# EAGLE schematic Main_Flam (EAGLE 7.1.0)
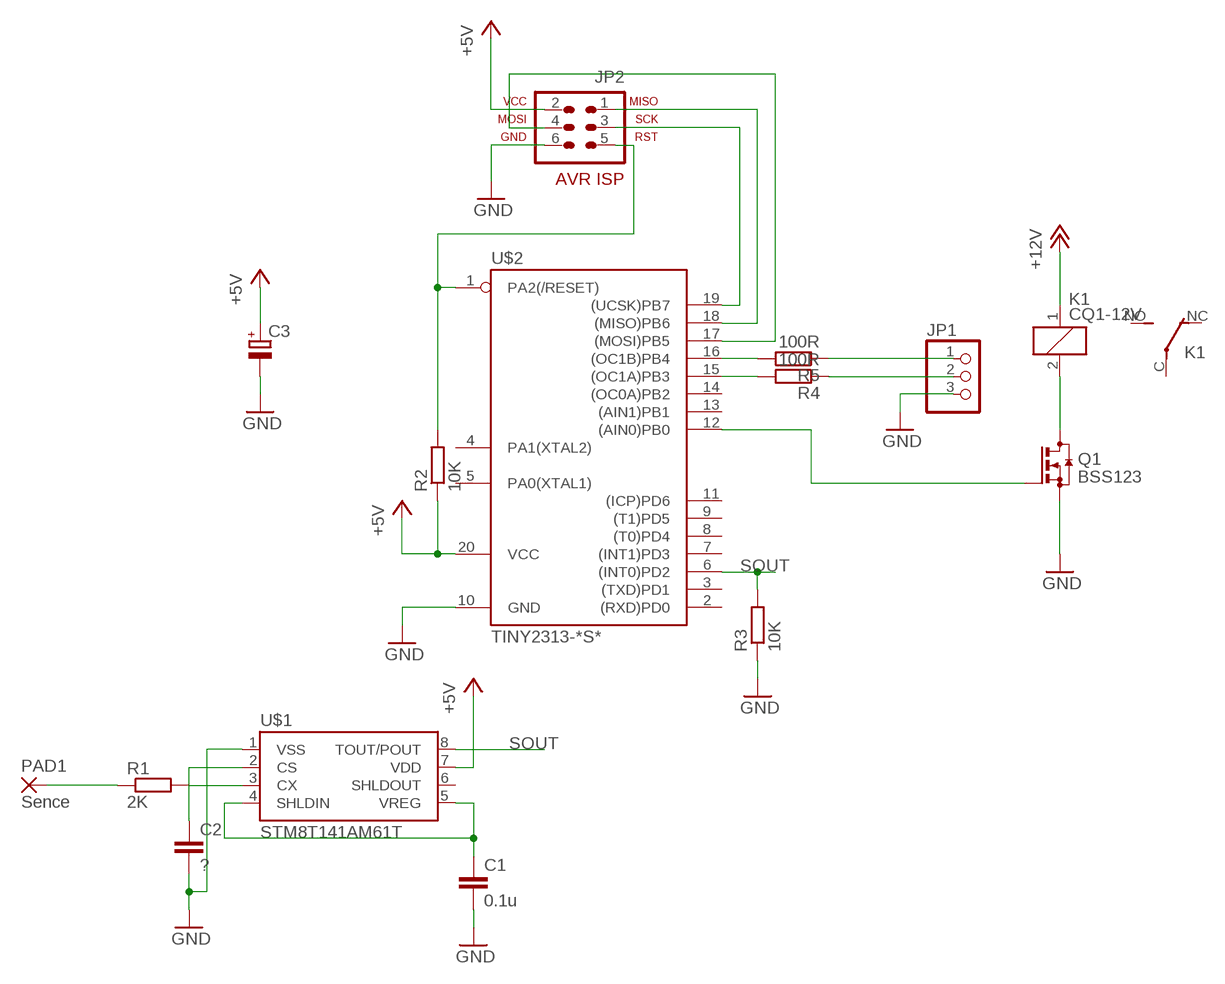
[diagram p0: schematic, sheet 1]

## Parts
C1  0.1u  C-EUC1206  [C1206]
C2  ?  C-EUC1206  [C1206]
C3  CPOL-EUSMCB  [SMC_B]
JP1  PINHD-1X3  [1X03]
JP2  AVR-ISP-6VERT  [AVR-ISP-6]
K1  CQ1-12V  [CQ1]
PAD1  Sence  2,54/0,8  [2,54/0,8]
Q1  BSS123  [SOT23]
R1  2K  R-EU_R1206  [R1206]
R2  10K  R-EU_R1206  [R1206]
R3  10K  R-EU_R1206  [R1206]
R4  100R  R-EU_R1206  [R1206]
R5  100R  R-EU_R1206  [R1206]
U$1  STM8T141AM61T  [SO8]
U$2  TINY2313-*S*  [SO20L$]

## Nets
+5V: C3.+ JP2.2 R2.1 U$1.7(VDD) U$2.20(VCC)
+12V: K1.1
GND: C1.2 C2.2 C3.- JP1.3 JP2.6 Q1.2(S) R3.1 U$1.1(VSS) U$2.10(GND)
N$1: R1.2 U$1.3(CX)
N$2: PAD1.1(P) R1.1
N$3: C1.1 U$1.4(SHLDIN) U$1.5(VREG)
N$4: C2.1 U$1.2(CS)
N$5: JP2.5 R2.2 U$2.1(PA2(/RESET))
N$6: R5.2 U$2.16((OC1B)PB4)
N$7: R4.2 U$2.15((OC1A)PB3)
N$8: JP1.2 R4.1
N$9: JP1.1 R5.1
N$10: Q1.1(G) U$2.12((AIN0)PB0)
N$11: K1.2 Q1.3(D)
N$12: JP2.1 U$2.18((MISO)PB6)
N$13: JP2.3 U$2.19((UCSK)PB7)
N$14: JP2.4 U$2.17((MOSI)PB5)
SOUT: R3.2 U$1.8(TOUT/POUT) U$2.6((INT0)PD2)
Unconnected: K1.C(2:P) K1.NC(2:O) K1.NO(2:S) U$1.6(SHLDOUT) U$2.2((RXD)PD0) U$2.3((TXD)PD1) U$2.4(PA1(XTAL2)) U$2.5(PA0(XTAL1)) U$2.7((INT1)PD3) U$2.8((T0)PD4) U$2.9((T1)PD5) U$2.11((ICP)PD6) U$2.13((AIN1)PB1) U$2.14((OC0A)PB2)

## Library data of the parts
C1 C2 = rcl:C-EU: CAPACITOR, European symbol
C3 = rcl:CPOL-EU: POLARIZED CAPACITOR, European symbol
JP1 = pinhead:PINHD-1X3: PIN HEADER
JP2 = avr-7:AVR-ISP-6: AVR ISP-6 Serial Programming Header
K1 = relay:CQ1-12V: AUTOMOTIVE QUIET RELAY NAiS Source: http://www.mew-europe.com/.. en_ds_61208_0000.pdf; OC_FARNELL: unknown; OC_NEWARK: unknown
PAD1 = wirepad:2,54/0,8: THROUGH-HOLE PAD
Q1 = transistor-small-signal:BSS123: N-CHANNEL MOS FET
R1-R5 = rcl:R-EU_: RESISTOR, European symbol
U$1 = Namenlos:STM8T141AM61T
U$2 = avr-7:TINY2313*: Atmel Tiny2313 2K Flash, 128 bytes EEPROM, 128 bytes RAM